# EAGLE design USBFilterQT (EAGLE 9.6.2)
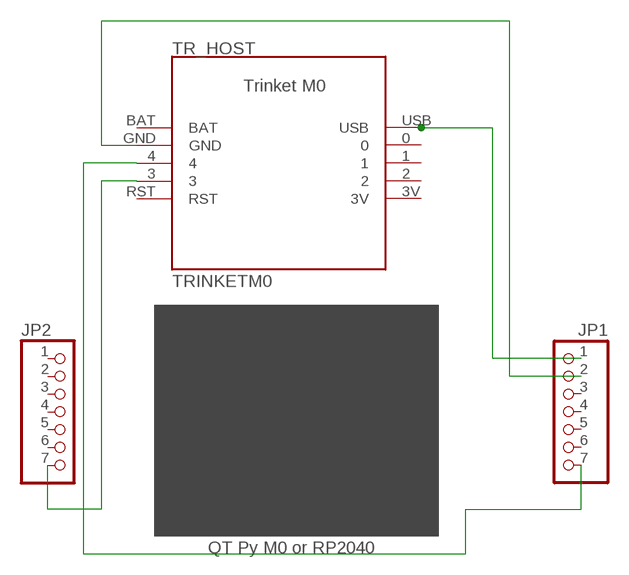
[diagram p0: schematic, sheet 1]

## Parts
JP1  PINHD-1X7  [1X07]
JP2  PINHD-1X7  [1X07]
TR_HOST  TRINKETM0  [TRINKET]

## Nets
GND: JP1.2 TR_HOST.GND
N$1: JP2.7 TR_HOST.3
N$2: JP1.7 TR_HOST.4
USB: JP1.1 TR_HOST.USB
Unconnected: JP1.3 JP1.4 JP1.5 JP1.6 JP2.1 JP2.2 JP2.3 JP2.4 JP2.5 JP2.6 TR_HOST.0 TR_HOST.1 TR_HOST.2 TR_HOST.3V TR_HOST.BAT TR_HOST.RST

## Notes on the sheet
- QT Py M0 or RP2040

## Library data of the parts
JP1 JP2 = pinhead:PINHD-1X7: PIN HEADER
TR_HOST = ATMakers:TRINKETM0: Trinket M0

## Board
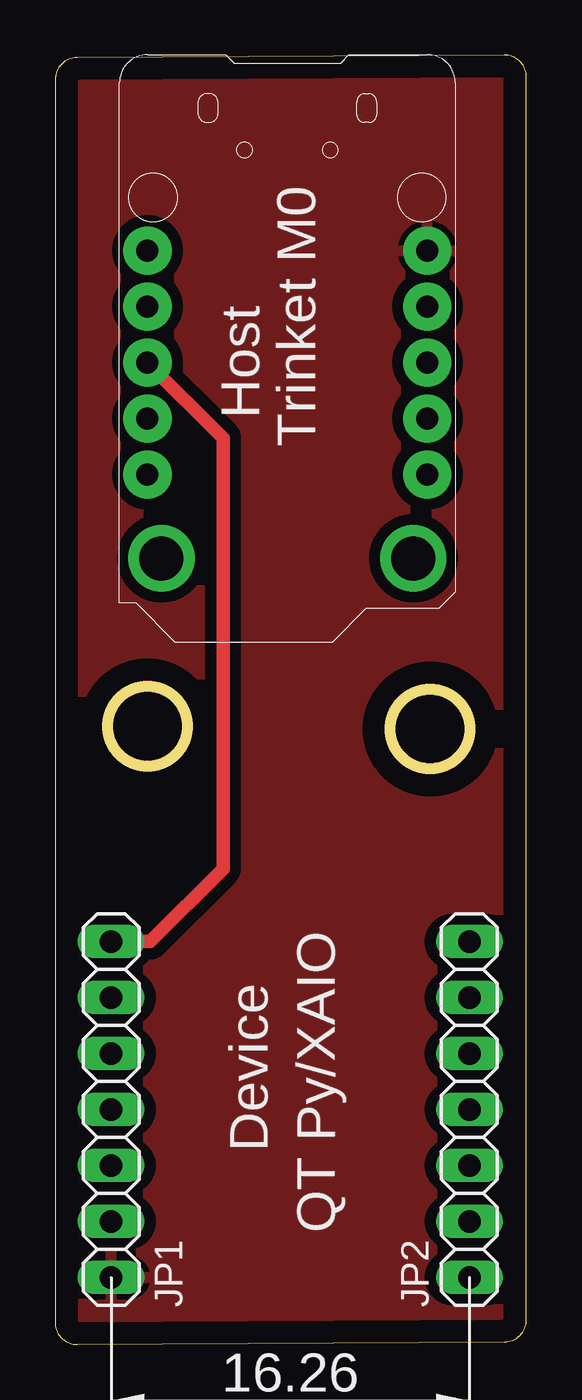
[diagram p1: board, top side]
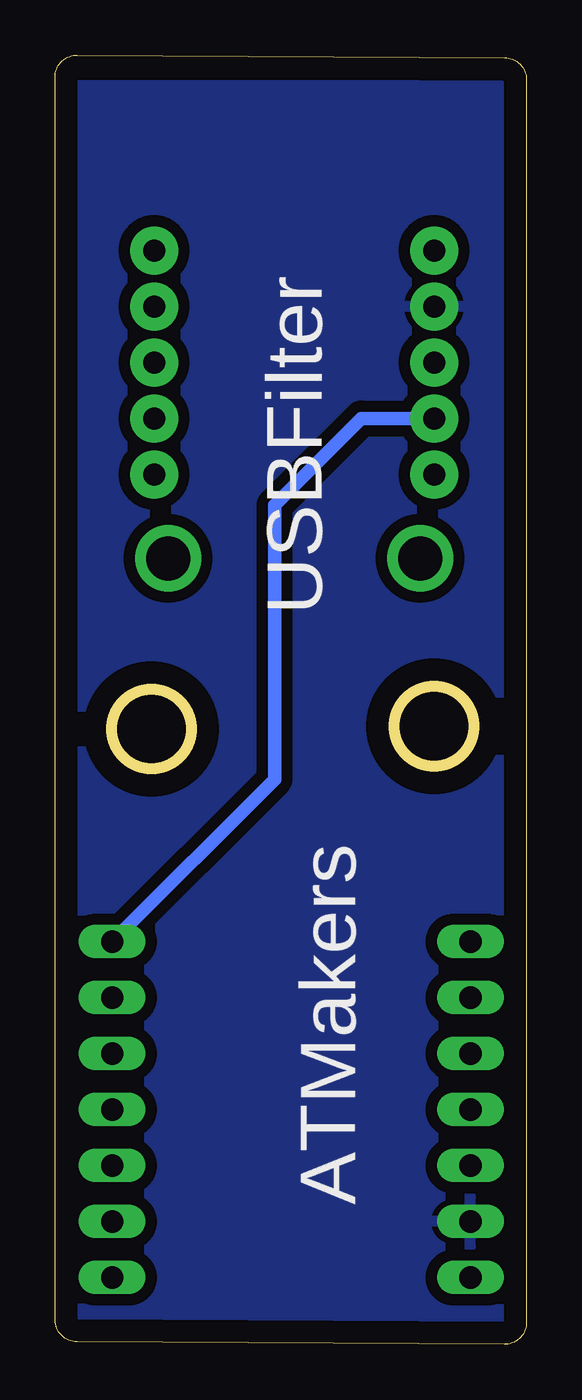
[diagram p2: board, bottom side, seen from below]

Size 21.39 x 58.53 mm. Coordinates in mm from the lower left corner, seen from the top.
Outline: 0,57.41 0,1 arc90 1.01,0 20.39,0.12 arc90 21.39,1.12 21.39,57.53 arc90 20.38,58.53 0.99,58.41 arc90 0,57.41
Outline: circle at 4.19,28.06 radius 1.8
Outline: circle at 17.02,27.93 radius 1.8
Copper layers (1*16): Top 0.035mm / dielectric 1.5mm / Bottom 0.035mm
Design rules "default *": minimum track width 6mil, minimum drill 0.35mm, track to track 6mil, track to pad 6mil, pad to pad 6mil, via to via 6mil, smd to smd 6mil, copper to edge 40mil, drill to drill 6mil, minimum pad ring 10mil, minimum via ring 8mil, stop-mask expansion 4mil, vias tented up to drill 20mil, thermal gap 10mil

### Footprints (pad centres in the part's own frame; a part is rotated, then mirrored left to right if it is on the bottom)
1X07 = drill 1.016 long: 1 -7.62,0; 2 -5.08,0; 3 -2.54,0; 4 0,0; 5 2.54,0; 6 5.08,0; 7 7.62,0
TRINKET = drill 1 pad 2.184: 0 6.35,1.27; 1 6.35,-1.27; 2 6.35,-3.81; 3 -6.35,-3.81; 3V 6.35,-6.35; 4 -6.35,-1.27; BAT -6.35,3.81; GND -6.35,1.27; RST -6.35,-6.35; USB 6.35,3.81 | drill 2 pad 3: TR11 -5.715,-10.16; TR12 5.715,-10.16

### Placement (x,y rotation side)
JP1  2.54,10.66 90 top
JP2  18.8,10.66 90 top
TR_HOST  10.54,45.84 0 top

### Tracks (layer width: path | path; a pad name or v marks a point on that pad's centre or on a via)
GND
  pour Bottom (isolate 0.508): -1.27,-0.01 -1.27,57.14 21.59,57.14 21.59,-0.01
N$1
  Bottom 0.61: JP2.7 11.43,25.65 11.43,38.09 7.49,42.03 TR_HOST.3
N$2
  Top 0.61: JP1.7 4.32,18.28 7.62,21.58 7.62,41.14 TR_HOST.4
USB
  pour Top (isolate 0.508): -1.27,-1.28 -1.27,58.41 21.59,58.41 21.59,-1.28

### Text on the board
tPlace: Host | Device | QT Py/XAIO
bPlace: USBFilter | ATMakers